# EAGLE design schematic (EAGLE 7.1.0)
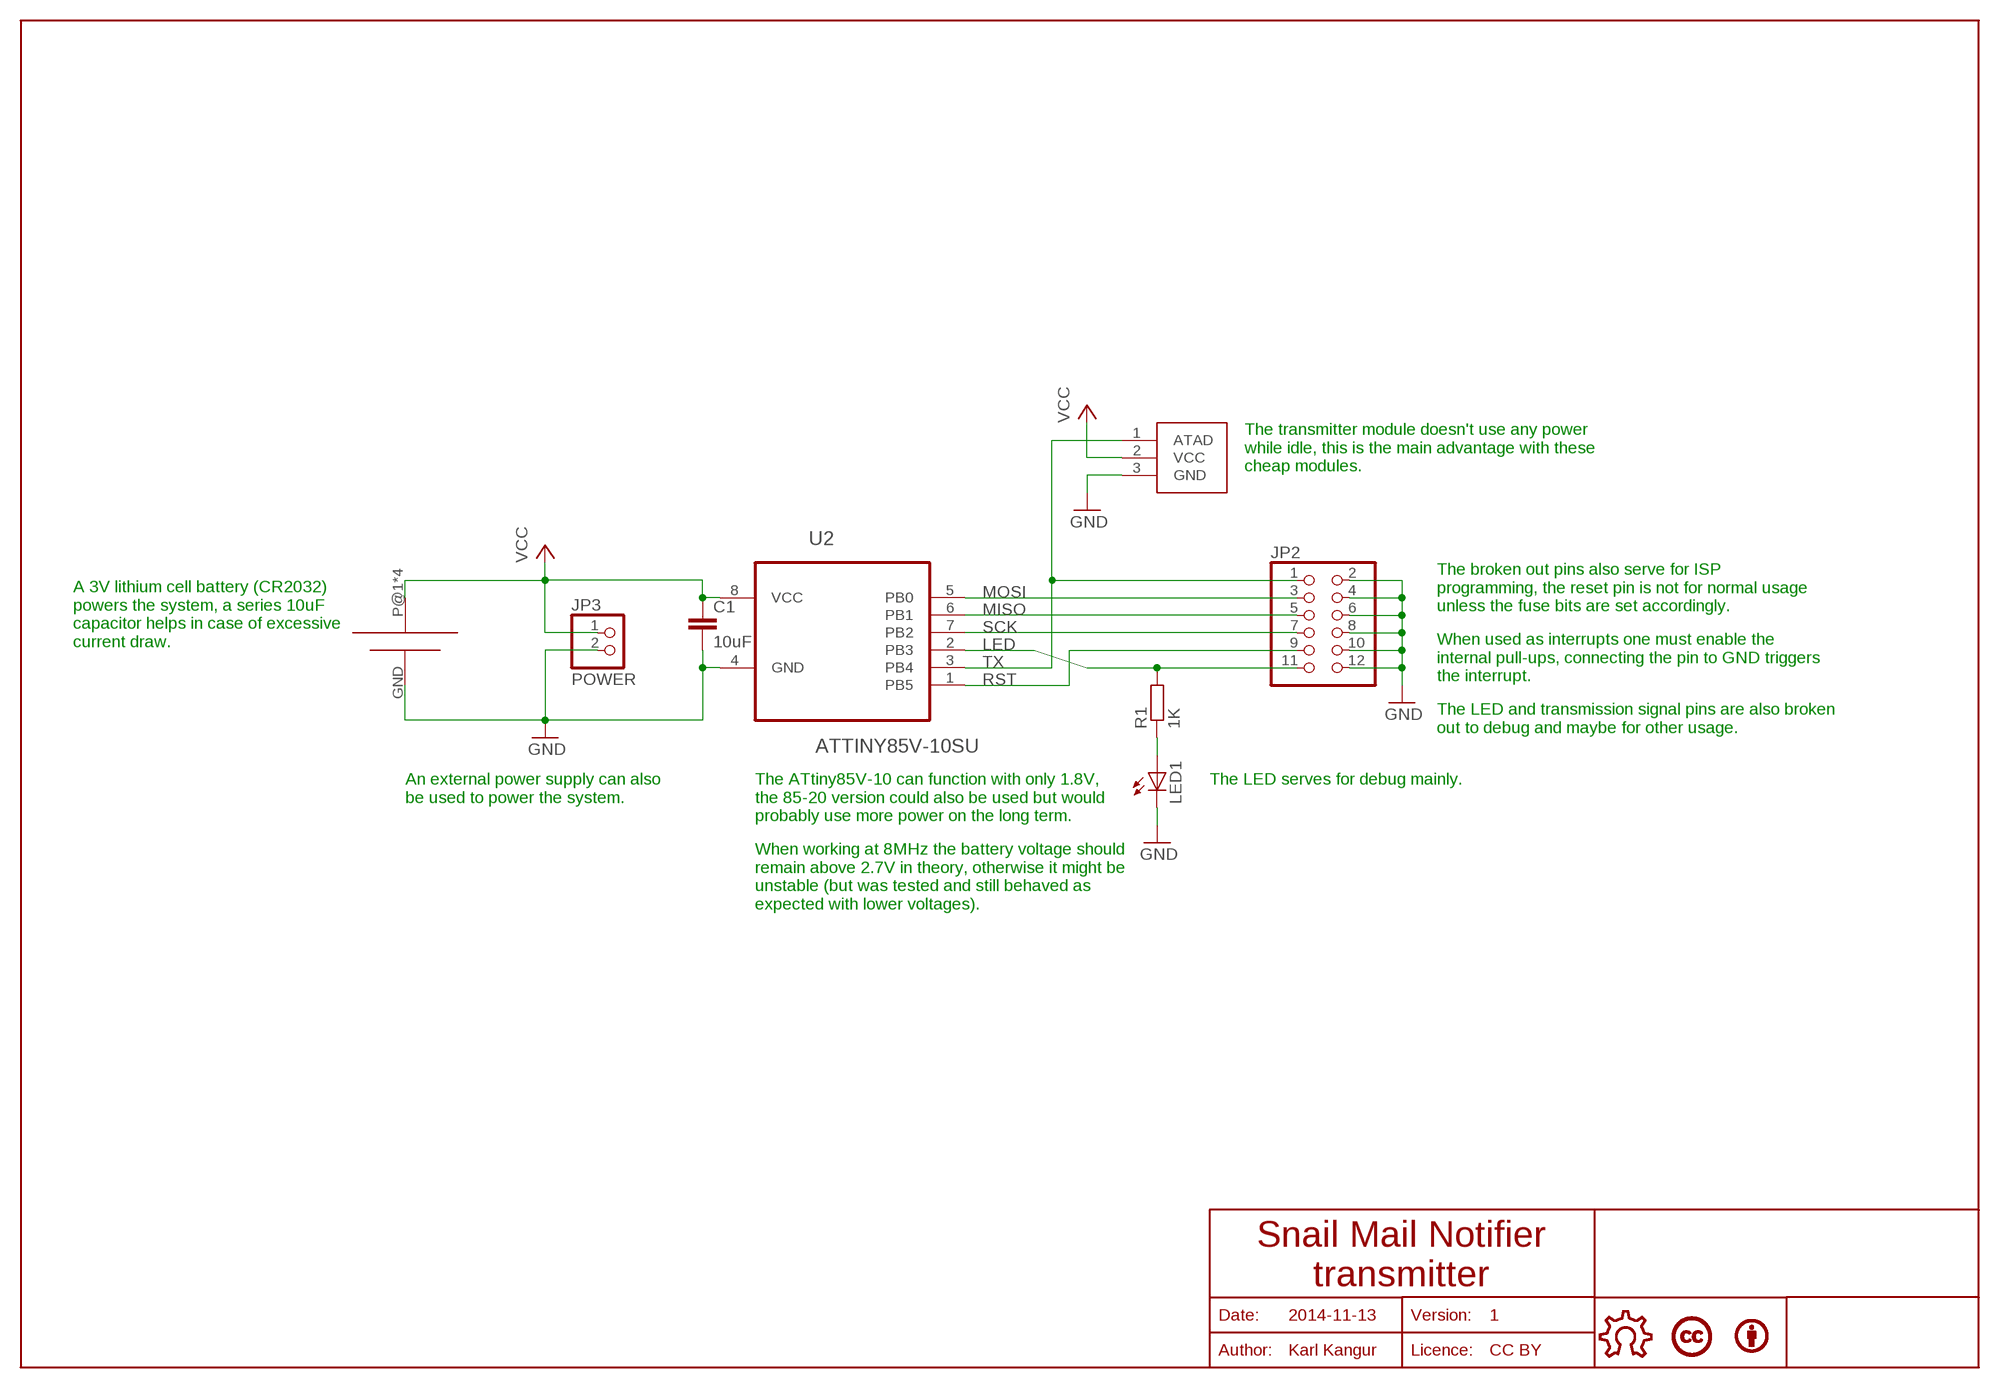
[diagram p0: schematic, sheet 1]

## Parts
BY1  BYBOTTOM  [BY]
C1  10uF  C-EUC0805  [C0805]
JP2  PINHD-2X6  [2X06]
JP3  POWER  PINHD-1X2  [1X02]
LED1  LEDCHIPLED_0805  [CHIPLED_0805]
LICENCE1  LICENCECC-BOTTOM  [CREATIVE-COMMONS]
R1  1K  R-EU_R0805  [R0805]
U2  ATTINY85V-10SU  [SOIC127P798X216-8N]
U$1  RF_LINK_TRANSMITTER  [RF_LINK_TRANSMITTER]
U$2  CR2032-BATTERY-HOLDER  [CR2032-BATTERY-HOLDER-PCB]
U$5  OPEN-HARDWARE-LOGOBOTTOM-SMALL  [OPEN-HARDWARE-BOTTOM-SMALL]

## Nets
GND: C1.2 JP2.2 JP2.4 JP2.6 JP2.8 JP2.10 JP2.12 JP3.2 LED1.C U2.4(GND) U$1.3(GND) U$2.GND(N)
LED: JP2.11 R1.2 U2.2(PB3)
MISO: JP2.5 U2.6(PB1)
MOSI: JP2.3 U2.5(PB0)
N$1: LED1.A R1.1
RST: JP2.9 U2.1(PB5)
SCK: JP2.7 U2.7(PB2)
TX: JP2.1 U2.3(PB4) U$1.1(ATAD)
VCC: C1.1 JP3.1 U2.8(VCC) U$1.2(VCC) U$2.P@1(P) U$2.P@2(P) U$2.P@3(P) U$2.P@4(P)

## Notes on the sheet
- The transmitter module doesn't use any power
  while idle, this is the main advantage with these
  cheap modules.
- The broken out pins also serve for ISP
  programming, the reset pin is not for normal usage
  unless the fuse bits are set accordingly.
- A 3V lithium cell battery (CR2032)
  powers the system, a series 10uF
  capacitor helps in case of excessive
  current draw.
- When used as interrupts one must enable the
  internal pull-ups, connecting the pin to GND triggers
  the interrupt.
- The LED and transmission signal pins are also broken
  out to debug and maybe for other usage.
- An external power supply can also
  be used to power the system.
- The ATtiny85V-10 can function with only 1.8V,
  the 85-20 version could also be used but would
  probably use more power on the long term.
- The LED serves for debug mainly.
- When working at 8MHz the battery voltage should
  remain above 2.7V in theory, otherwise it might be
  unstable (but was tested and still behaved as
  expected with lower voltages).
- Snail Mail Notifier
  transmitter
- Date: | 2014-11-13 | Version: | 1
- Author: | Karl Kangur | Licence: | CC BY

## Library data of the parts
BY1 = robopoly:BY
C1 = rcl:C-EU: CAPACITOR, European symbol
JP2 = pinhead:PINHD-2X6: PIN HEADER
JP3 = pinhead:PINHD-1X2: PIN HEADER
LED1 = led:LED: LED OSRAM: - CHIPLED LG R971, LG N971, LY N971, LG Q971, LY Q971, LO R971, LY R971 LH N974, LH R974 LS Q976, LO Q976, LY Q976 LO Q996 - Hyper CHIPLED LW Q18S LB Q993, LB Q99A, LB R99A - SideLED LS A670, LO A670, LY A670, LG A670, LP A670 LB A673, LV A673, LT A673, LW A673 LH A674 LY A675 LS A676, LA A676, LO A676, LY A676, LW A676 LS A679, LY A679, LG A679 - Hyper Micro SIDELED® LS Y876, LA Y876, LO Y876, LY Y876 LT Y87S - SmartLED LW L88C, LW L88S LB L89C, LB L89S, LG L890 LS L89K, LO L89K, LY L89K LS L896, LA L896, LO L896, LY L896 - TOPLED LS T670, LO T670, LY T670, LG T670, LP T670 LSG T670, LSP T670, LSY T670, LOP T670, LYG T670 LG T671, LOG T671, LSG T671 LB T673, LV T673, LT T673, LW T673 LH T674 LS T676, LA T676, LO T676, LY T676, LB T676, LH T676, LSB T676, LW T676 LB T67C, LV T67C, LT T67C, LS T67K, LO T67K, LY T67K, LW E67C LS E67B, LA E67B, LO E67B, LY E67B, LB E67C, LV E67C, LT E67C LW T67C LS T679, LY T679, LG T679 LS T770, LO T770, LY T770, LG T770, LP T770 LB T773, LV T773, LT T773, LW T773 LH T774 LS E675, LA E675, LY E675, LS T675 LS T776, LA T776, LO T776, LY T776, LB T776 LHGB T686 LT T68C, LB T68C - Hyper Mini TOPLED® LB M676 - Mini TOPLED Santana® LG M470 LS M47K, LO M47K, LY M47K Source: http://www.osram.convergy.de LUXEON: - LUMILED® LXK2-PW12-R00, LXK2-PW12-S00, LXK2-PW14-U00, LXK2-PW14-V00 LXK2-PM12-R00, LXK2-PM12-S00, LXK2-PM14-U00 LXK2-PE12-Q00, LXK2-PE12-R00, LXK2-PE12-S00, LXK2-PE14-T00, LXK2-PE14-U00 LXK2-PB12-K00, LXK2-PB12-L00, LXK2-PB12-M00, LXK2-PB14-N00, LXK2-PB14-P00, LXK2-PB14-Q00 LXK2-PR12-L00, LXK2-PR12-M00, LXK2-PR14-Q00, LXK2-PR14-R00 LXK2-PD12-Q00, LXK2-PD12-R00, LXK2-PD12-S00 LXK2-PH12-R00, LXK2-PH12-S00 LXK2-PL12-P00, LXK2-PL12-Q00, LXK2-PL12-R00 Source: www.luxeon.com KINGBRIGHT: KA-3528ASYC Source: www.kingbright.com
LICENCE1 = robopoly:LICENCE
R1 = resistor:R-EU_: RESISTOR, European symbol; SPICEPREFIX: R
U2 = Atmel_By_element14_Batch_1-00:ATTINY85V-10SU: 8-bit Microcontroller with In-System Programmable Flash; MPN: ATTINY85V-10SU; OC_FARNELL: 1455166; OC_NEWARK: 58M3799; PACKAGE: SOIC-8; SUPPLIER: Atmel
U$1 = robopoly:RF_LINK_TRANSMITTER
U$2 = robopoly:CR2032-BATTERY-HOLDER
U$5 = robopoly:OPEN-HARDWARE-LOGO

## Board
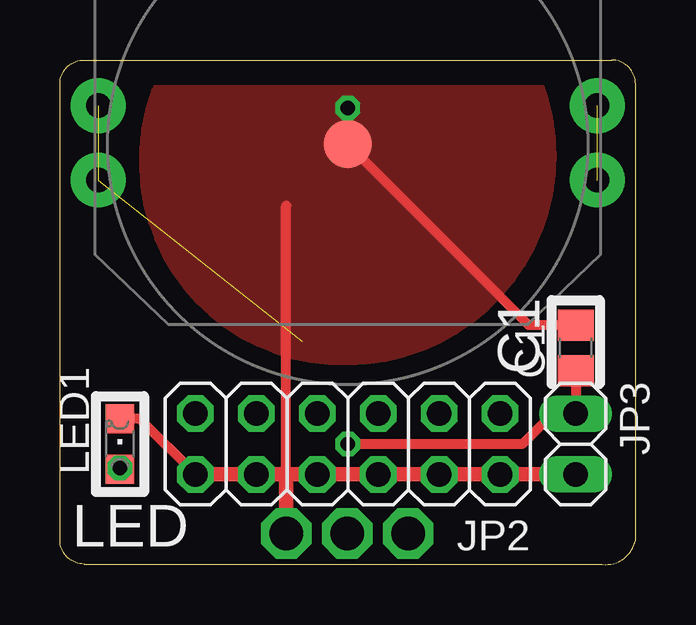
[diagram p1: board, top side]
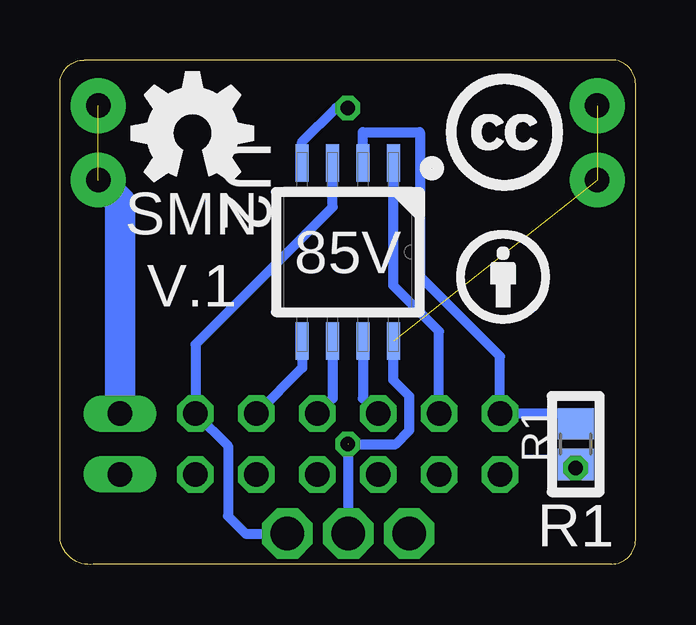
[diagram p2: board, bottom side, seen from below]

Size 24 x 21.02 mm. Coordinates in mm from the lower left corner, seen from the top.
Outline: 1,0.02 22.5,0.02 arc90 24,1.02 24,20.02 arc90 23,21.02 1,21.02 arc90 0,20.02 0,1.02 arc90 1,0.02
Copper layers (1*16): Top 0.035mm / dielectric 1.5mm / Bottom 0.035mm
Design rules "default": minimum track width 10mil, minimum drill 24mil, track to track 8mil, track to pad 8mil, pad to pad 8mil, via to via 8mil, smd to smd 8mil, copper to edge 40mil, drill to drill 8mil, minimum pad ring 10mil, minimum via ring 8mil, stop-mask expansion 4mil, vias tented up to drill 0mil, thermal gap 10mil

### Footprints (pad centres in the part's own frame; a part is rotated, then mirrored left to right if it is on the bottom)
C0805 = smd 1.3 x 1.5: 1 -0.95,0; 2 0.95,0
2X06 = drill 1.016 octagon: 1 -6.35,-1.27; 2 -6.35,1.27; 3 -3.81,-1.27; 4 -3.81,1.27; 5 -1.27,-1.27; 6 -1.27,1.27; 7 1.27,-1.27; 8 1.27,1.27; 9 3.81,-1.27; 10 3.81,1.27; 11 6.35,-1.27; 12 6.35,1.27
1X02 = drill 1.016 long: 1 -1.27,0; 2 1.27,0
CHIPLED_0805 = smd 1.2 x 1.2: A 0,-1.05; C 0,1.05
R0805 = smd 1.3 x 1.5: 1 -0.85,0; 2 0.85,0
SOIC127P798X216-8N = smd 1.549 x 0.533: 1 -3.708,1.905; 2 -3.708,0.635; 3 -3.708,-0.635; 4 -3.708,-1.905; 5 3.708,-1.905; 6 3.708,-0.635; 7 3.708,0.635; 8 3.708,1.905
RF_LINK_TRANSMITTER = drill 1.4 octagon: 1 6.985,1.27; 2 9.525,1.27; 3 12.065,1.27
CR2032-BATTERY-HOLDER-PCB = smd 2 x 2: GND 0,0 | drill 1.016 pad 2.286: P@1 -10.4,1.5; P@2 -10.4,-1.6; P@3 10.4,1.5; P@4 10.4,-1.6

### Placement (x,y rotation side)
BY1  5.5,12.02 0 top
C1  21.5,9.02 90 top
JP2  12,5.02 180 top
JP3  21.5,5.02 270 top
LED1  2.5,5.02 0 top
LICENCE1  5.5,18.02 0 top
R1  2.5,5.02 90 bottom
U2  12,13.02 270 bottom
U$1  21.5,0.02 0 bottom
U$2  12,17.52 180 top
U$5  18.5,18.02 0 top

### Tracks (layer width: path | path; a pad name or v marks a point on that pad's centre or on a via)
GND  (via drill 0.6)
  Top 0.406: 9.44,3.52 9.44,14.96 | JP2.12 3.33,6.07 LED1.C | C1.2 19.55,9.97 U$2.GND
  Top 0.61: JP2.2 JP2.4 JP2.6 JP2.8 9.44,3.75 | U$1.3 9.44,3.52 9.44,3.75 | JP3.2 JP2.2 | JP2.2 18.32,3.75 | 9.44,3.75 JP2.10 JP2.12
  Bottom 0.406: U2.4 13.9,17.62 12.5,19.02 v12,19.02
  pour Top (no thermals): 3.5,16.52 arc90 12,8.52 arc90 20.5,17.02 arc90 12,25.52 arc90
LED
  Bottom 0.406: U2.2 11.37,18.02 9,18.02 9,12.02 5.65,8.67 JP2.11 2.92,6.29 R1.2
MISO
  Bottom 0.406: U2.6 12.63,6.93 JP2.5
MOSI
  Bottom 0.406: U2.5 13.9,8.2 JP2.3
N$1  (via drill 0.6)
  Top 0.406: LED1.A v2.5,4.02
  Bottom 0.406: v2.5,4.02 R1.1
RST
  Bottom 0.406: U2.1 10.1,11.62 8.19,9.71 JP2.9
SCK
  Bottom 0.406: U2.7 11.37,6.93 JP2.7
TX
  Bottom 0.406: U$1.1 16.27,1.29 17,2.02 17,4.94 JP2.1 18.35,9.17 12.63,14.89 U2.3
VCC  (via drill 0.6)  (4 unrouted)
  Top 0.406: 20.77,6.29 JP3.1 | JP3.1 20.55,6.29 19.28,5.02 v12,5.02 | C1.1 JP3.1
  Bottom 0.406: 11.97,5.02 10,5.02 9.44,5.59 9.44,7.02 10.1,7.68 U2.8 | v12,5.02 12,1.32 U$1.2
  Bottom 1.27: U$2.P@1 21.5,15.12 JP3.1

### Text on the board
tPlace: C1 | LED
bPlace: SMN | 85V | V.1 | R1
Document: Snail Mail Notifier transmitter | Version: 1 | 2014-09-11 | Author: Karl Kangur | Licence: CC-BY